# EAGLE design DummyLoad (EAGLE 5.10)

## Sheet 1 of 4
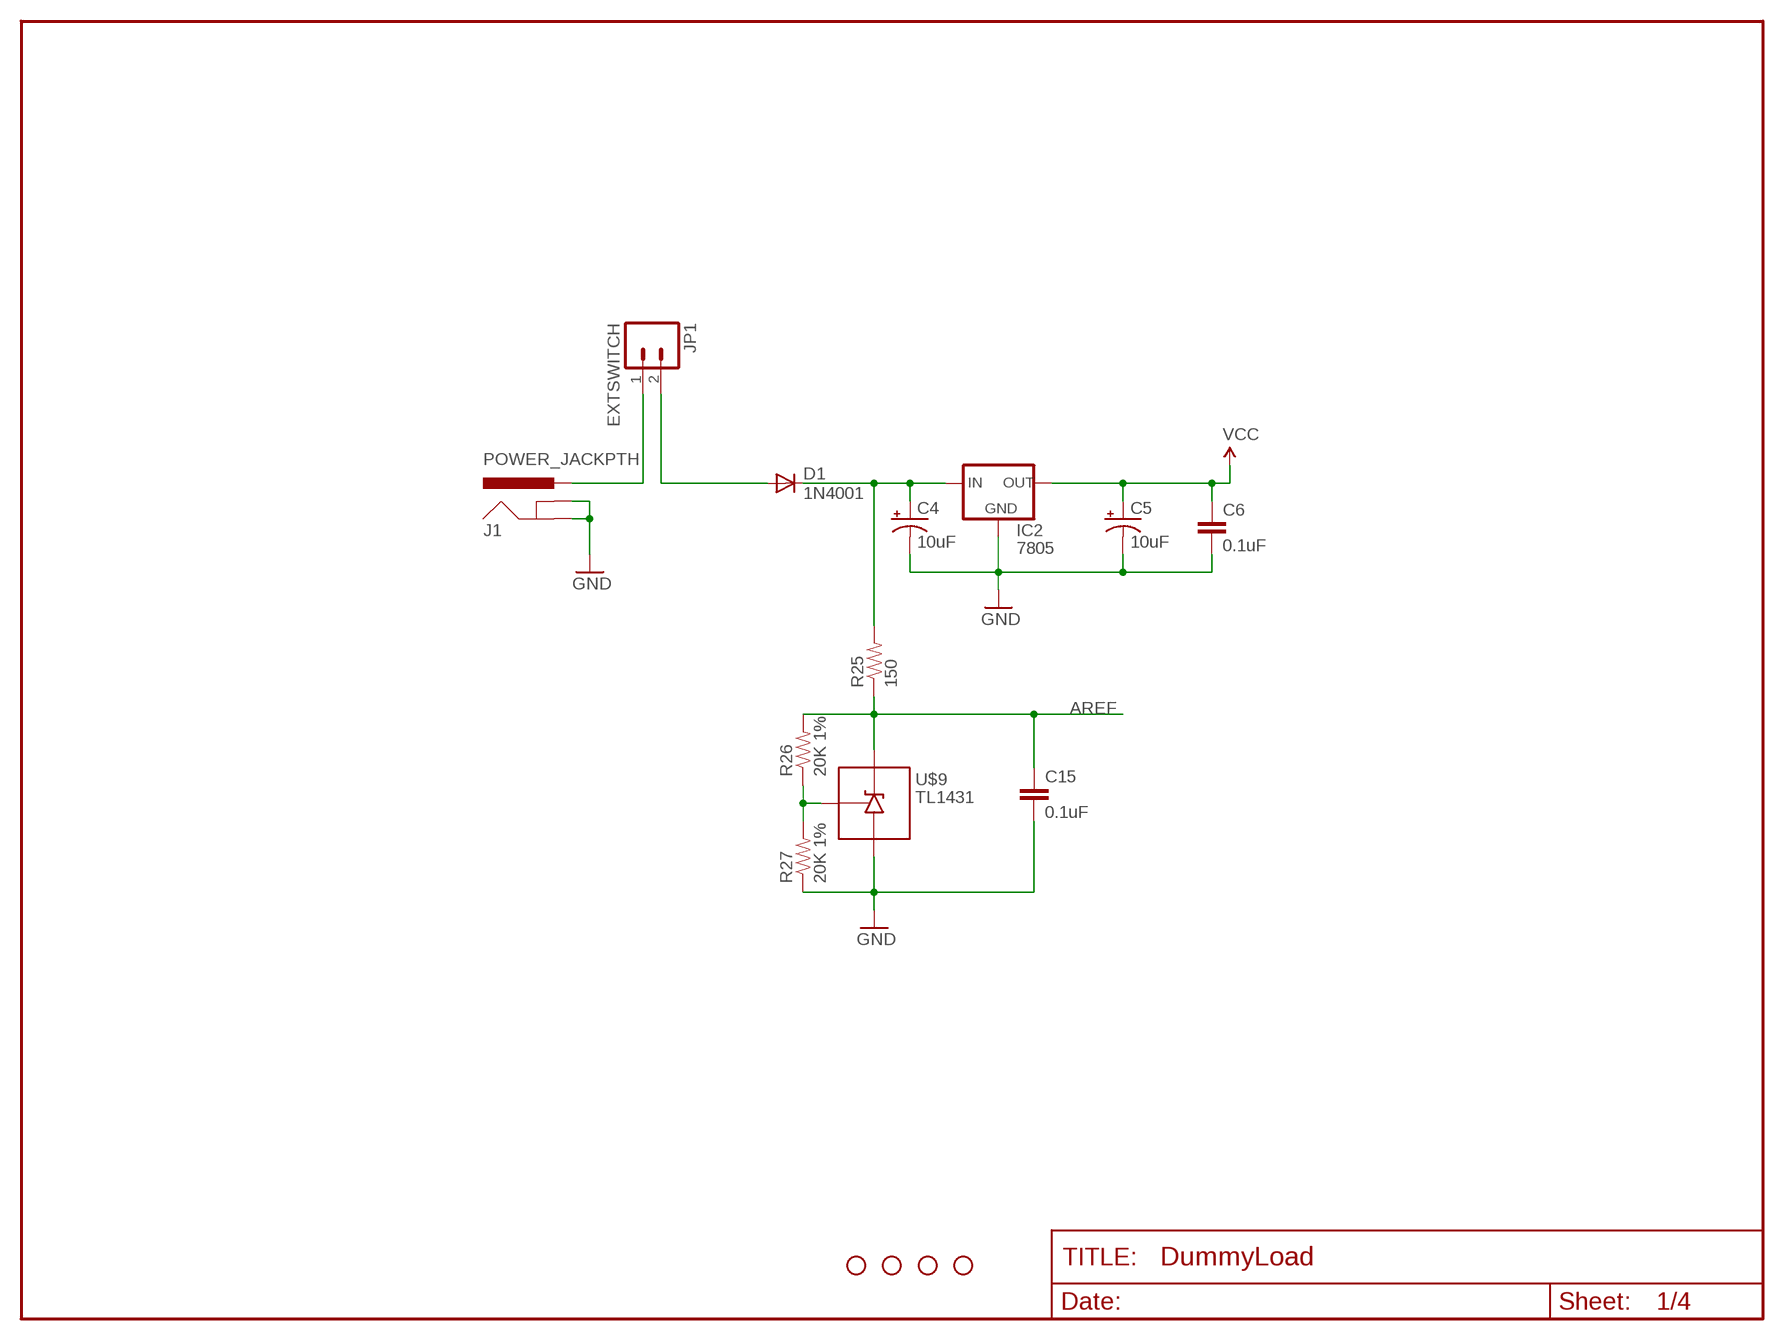
[diagram p0: schematic, sheet 1]

### Parts
C4  10uF  CAP_POLPTH2  [CPOL-RADIAL-10UF-25V]
C5  10uF  CAP_POLPTH2  [CPOL-RADIAL-10UF-25V]
C6  0.1uF  CAP1206  [1206]
C15  0.1uF  CAP1206  [1206]
D1  1N4001  DIODEPTH  [DIODE-1N4001]
IC2  7805  V_REG_78XXSINK  [TO220-IGO]
J1  POWER_JACKPTH  [POWER_JACK_PTH]
JP1  EXTSWITCH  M02PTH  [1X02]
R25  150  RESISTOR1206  [1206]
R26  20K 1%  RESISTOR1206  [1206]
R27  20K 1%  RESISTOR1206  [1206]
U$9  TL1431  [TO-92]
U$11  STANDOFF  [STANDOFF_0.14]
U$12  STANDOFF  [STANDOFF_0.14]
U$13  STANDOFF  [STANDOFF_0.14]
U$14  STANDOFF  [STANDOFF_0.14]

### Nets
AREF: C15.1 R25.1 R26.2 U$9.3(C) ; also sheet 2
GND: C4.2(-) C5.2(-) C6.2 C15.2 IC2.GND J1.GND J1.GNDBREAK R27.1 U$9.2(A) ; also sheet 2,3,4
N$1: J1.PWR JP1.1
N$2: C4.1(+) D1.C IC2.IN R25.2
N$21: D1.A JP1.2
VCC: C5.1(+) C6.1 IC2.OUT ; also sheet 2,3,4
VREF: R26.1 R27.2 U$9.1(REF)

## Sheet 2 of 4
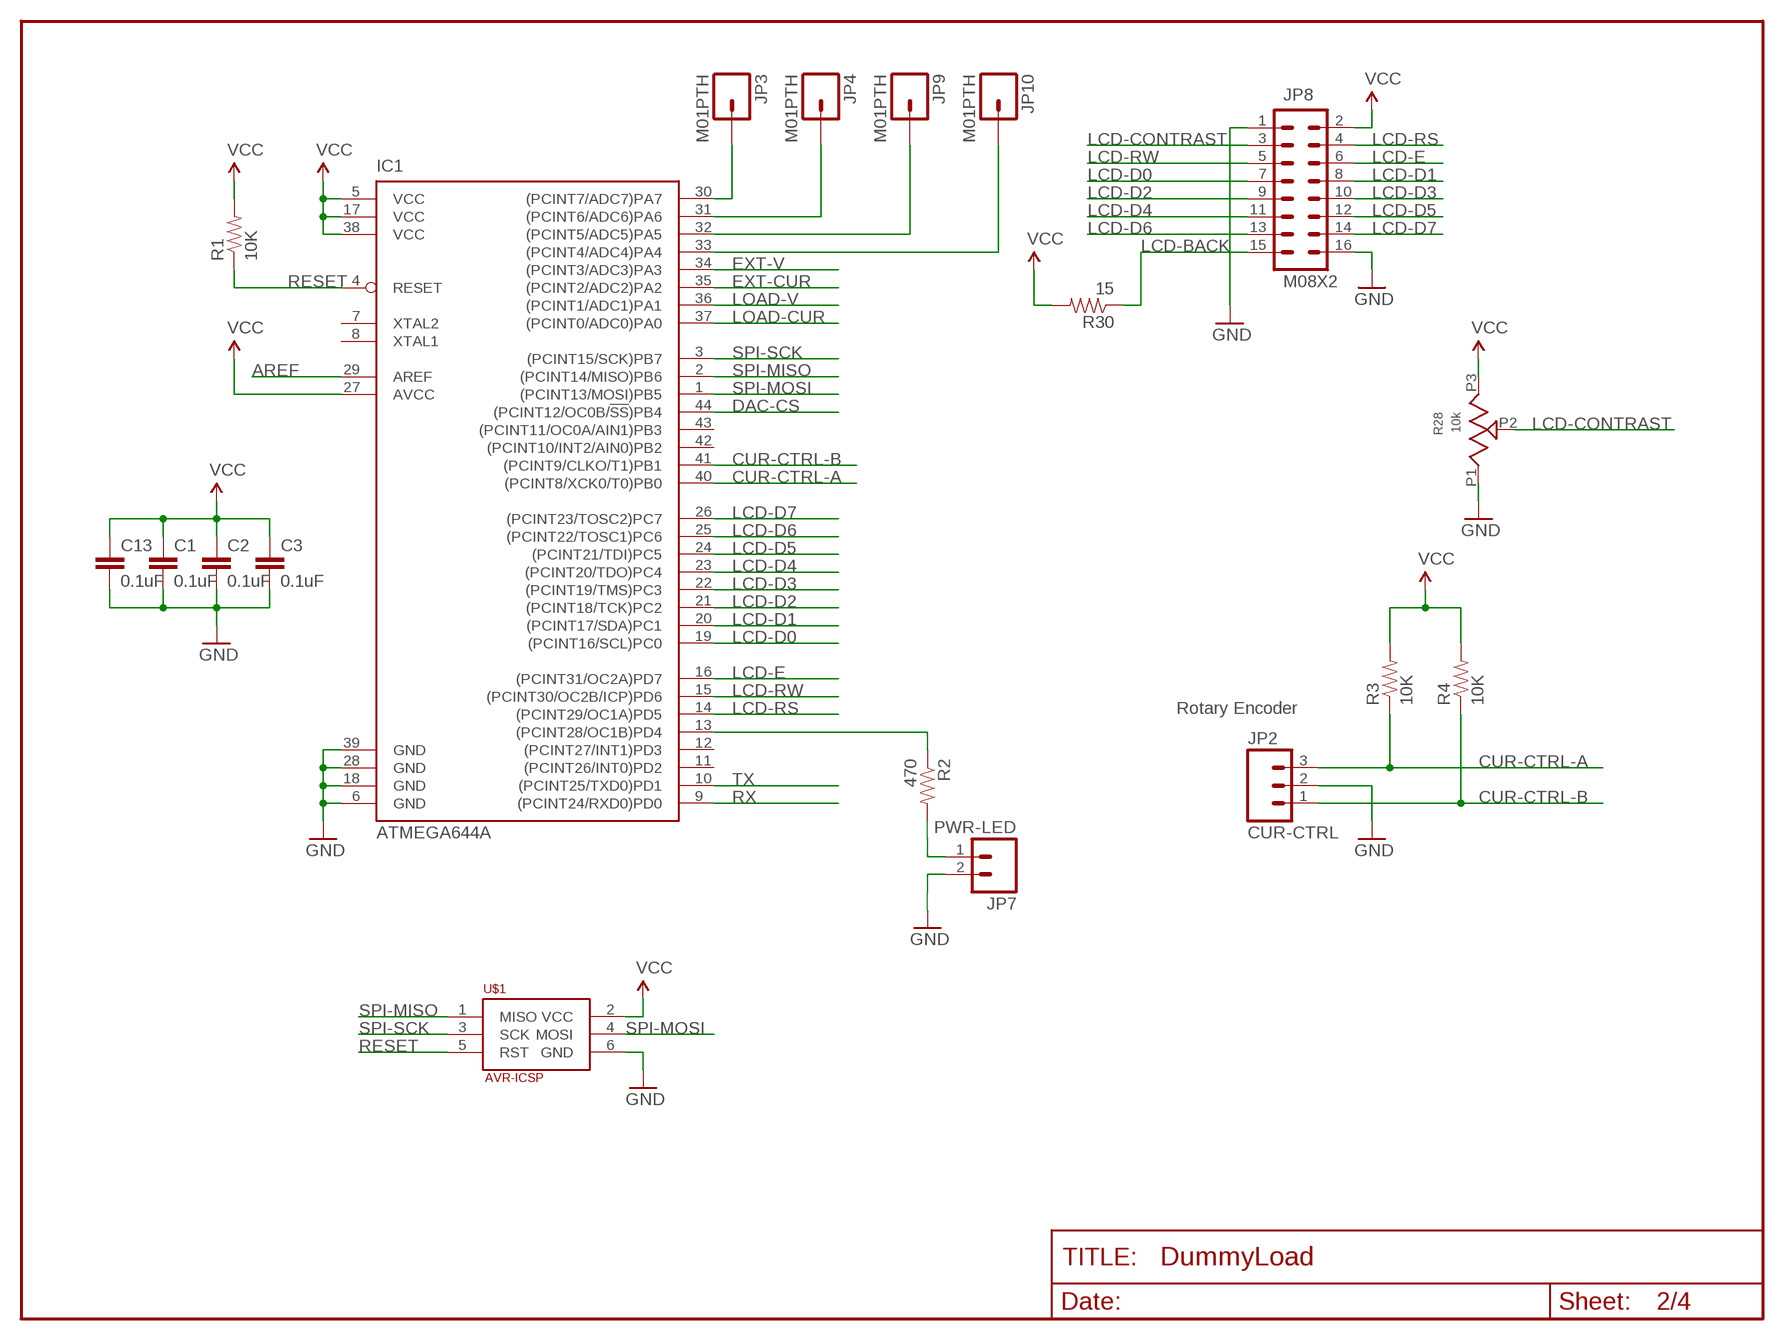
[diagram p1: schematic, sheet 2]

### Parts
C1  0.1uF  CAP1206  [1206]
C2  0.1uF  CAP1206  [1206]
C3  0.1uF  CAP1206  [1206]
C13  0.1uF  CAP1206  [1206]
IC1  ATMEGA644A  [TQFP44]
JP2  CUR-CTRL  M03PTH  [1X03]
JP3  M01PTH  [1X01]
JP4  M01PTH  [1X01]
JP7  PWR-LED  M02PTH  [1X02]
JP8  M08X2  [2X8]
JP9  M01PTH  [1X01]
JP10  M01PTH  [1X01]
R1  10K  RESISTOR1206  [1206]
R2  470  RESISTOR1206  [1206]
R3  10K  RESISTOR1206  [1206]
R4  10K  RESISTOR1206  [1206]
R28  10k  POT-3362H  [POT-3362H]
R30  15  RESISTOR1206  [1206]
U$1  AVR-ICSP  [AVR-ICSP]

### Nets
AREF: IC1.29(AREF) ; also sheet 1
CUR-CTRL-A: IC1.40((PCINT8/XCK0/T0)PB0) JP2.3 R3.1
CUR-CTRL-B: IC1.41((PCINT9/CLKO/T1)PB1) JP2.1 R4.1
DAC-CS: IC1.44((PCINT12/OC0B/!SS!)PB4) ; also sheet 3
EXT-CUR: IC1.35((PCINT2/ADC2)PA2) ; also sheet 3
EXT-V: IC1.34((PCINT3/ADC3)PA3) ; also sheet 3
GND: C1.2 C2.2 C3.2 C13.2 IC1.6(GND) IC1.18(GND) IC1.28(GND) IC1.39(GND) JP2.2 JP7.2 JP8.1 JP8.16 R28.P1(PA) U$1.6(GND) ; also sheet 1,3,4
LCD-BACK: JP8.15 R30.1
LCD-CONTRAST: JP8.3 R28.P2(PWIPER)
LCD-D0: IC1.19((PCINT16/SCL)PC0) JP8.7
LCD-D1: IC1.20((PCINT17/SDA)PC1) JP8.8
LCD-D2: IC1.21((PCINT18/TCK)PC2) JP8.9
LCD-D3: IC1.22((PCINT19/TMS)PC3) JP8.10
LCD-D4: IC1.23((PCINT20/TDO)PC4) JP8.11
LCD-D5: IC1.24((PCINT21/TDI)PC5) JP8.12
LCD-D6: IC1.25((PCINT22/TOSC1)PC6) JP8.13
LCD-D7: IC1.26((PCINT23/TOSC2)PC7) JP8.14
LCD-E: IC1.16((PCINT31/OC2A)PD7) JP8.6
LCD-RS: IC1.14((PCINT29/OC1A)PD5) JP8.4
LCD-RW: IC1.15((PCINT30/OC2B/ICP)PD6) JP8.5
LOAD-CUR: IC1.37((PCINT0/ADC0)PA0) ; also sheet 3
LOAD-V: IC1.36((PCINT1/ADC1)PA1) ; also sheet 3
N$3: IC1.13((PCINT28/OC1B)PD4) R2.1
N$4: JP7.1 R2.2
N$22: IC1.30((PCINT7/ADC7)PA7) JP3.1
N$23: IC1.31((PCINT6/ADC6)PA6) JP4.1
N$24: IC1.32((PCINT5/ADC5)PA5) JP9.1
N$25: IC1.33((PCINT4/ADC4)PA4) JP10.1
RESET: IC1.4(RESET) R1.1 U$1.5(RST)
RX: IC1.9((PCINT24/RXD0)PD0) ; also sheet 4
SPI-MISO: IC1.2((PCINT14/MISO)PB6) U$1.1(MISO)
SPI-MOSI: IC1.1((PCINT13/MOSI)PB5) U$1.4(MOSI) ; also sheet 3
SPI-SCK: IC1.3((PCINT15/SCK)PB7) U$1.3(SCK) ; also sheet 3
TX: IC1.10((PCINT25/TXD0)PD1) ; also sheet 4
VCC: C1.1 C2.1 C3.1 C13.1 IC1.5(VCC) IC1.17(VCC) IC1.27(AVCC) IC1.38(VCC) JP8.2 R1.2 R3.2 R4.2 R28.P3(PB) R30.2 U$1.2(VCC) ; also sheet 1,3,4
Unconnected: IC1.7(XTAL2) IC1.8(XTAL1) IC1.11((PCINT26/INT0)PD2) IC1.12((PCINT27/INT1)PD3) IC1.42((PCINT10/INT2/AIN0)PB2) IC1.43((PCINT11/OC0A/AIN1)PB3)

### Notes on the sheet
- Rotary Encoder

## Sheet 3 of 4
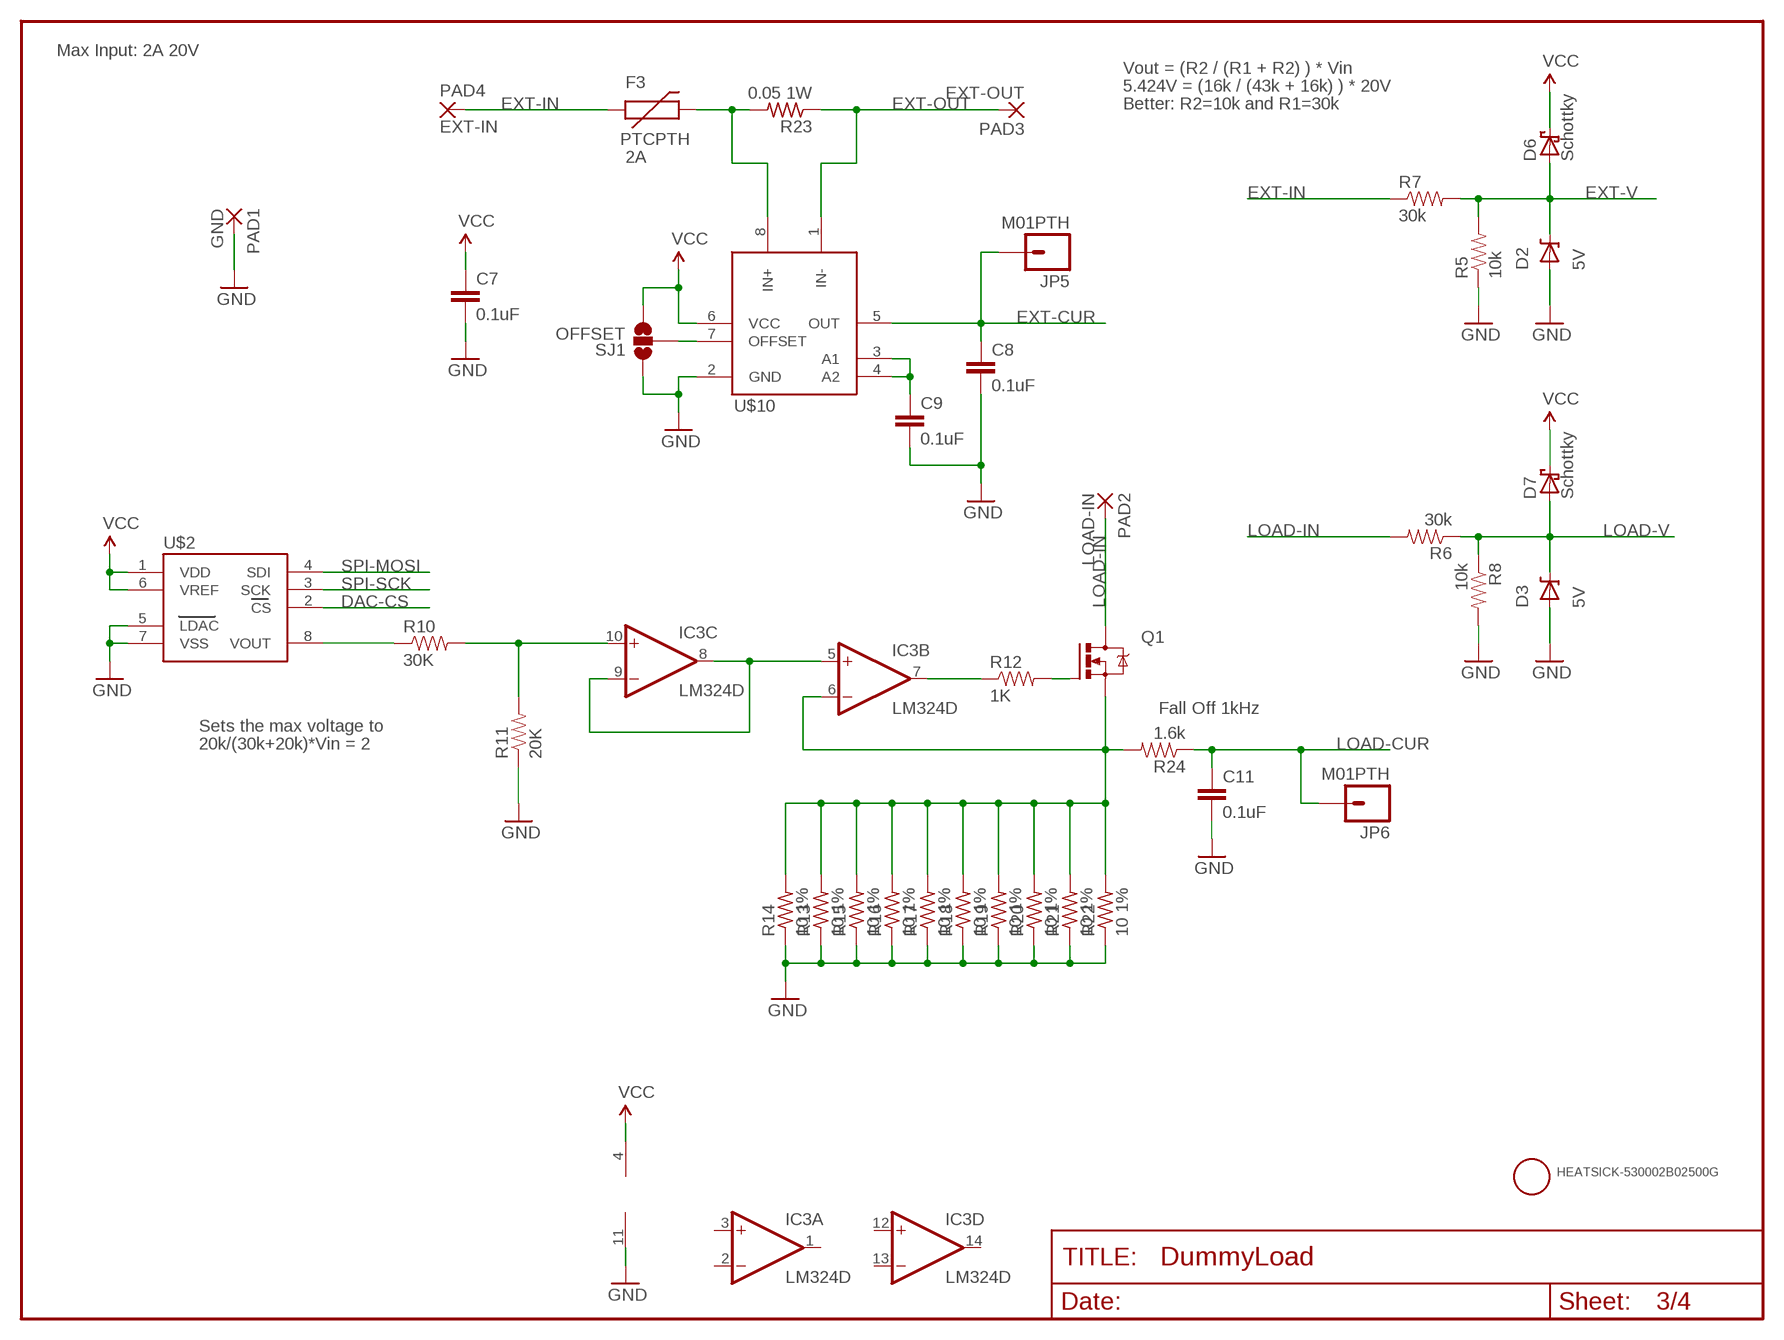
[diagram p2: schematic, sheet 3]

### Parts
C7  0.1uF  CAP1206  [1206]
C8  0.1uF  CAP1206  [1206]
C9  0.1uF  CAP1206  [1206]
C11  0.1uF  CAP1206  [1206]
D2  DIODE-ZENERPTH  [DIODE-ZENER]
D3  DIODE-ZENERPTH  [DIODE-ZENER]
D6  Schottky  DIODE-SCHOTTKY  [DIODE]
D7  Schottky  DIODE-SCHOTTKY  [DIODE]
F3  PTCPTH  [PTC]
IC3  LM324D  [SO14]
JP5  M01PTH  [1X01]
JP6  M01PTH  [1X01]
PAD1  GND  3,17/1,3  [3,17/1,3]
PAD2  LOAD-IN  3,17/1,3  [3,17/1,3]
PAD3  EXT-OUT  3,17/1,3  [3,17/1,3]
PAD4  EXT-IN  3,17/1,3  [3,17/1,3]
Q1  IRF520  [TO220BV]
R5  10k  RESISTOR1206  [1206]
R6  30k  RESISTOR1206  [1206]
R7  30k  RESISTOR1206  [1206]
R8  10k  RESISTOR1206  [1206]
R10  30K  RESISTOR1206  [1206]
R11  20K  RESISTOR1206  [1206]
R12  1K  RESISTOR1206  [1206]
R13  10 1%  R-US_0411/15  [0411/15]
R14  10 1%  R-US_0411/15  [0411/15]
R15  10 1%  R-US_0411/15  [0411/15]
R16  10 1%  R-US_0411/15  [0411/15]
R17  10 1%  R-US_0411/15  [0411/15]
R18  10 1%  R-US_0411/15  [0411/15]
R19  10 1%  R-US_0411/15  [0411/15]
R20  10 1%  R-US_0411/15  [0411/15]
R21  10 1%  R-US_0411/15  [0411/15]
R22  10 1%  R-US_0411/15  [0411/15]
R23  0.05 1W  R-US_0617/17  [0617/17]
R24  1.6k  RESISTOR1206  [1206]
SJ1  OFFSET  SOLDERJUMPER_2WAYS  [SJ_3]
U$2  MCP49X1  [TSSOP8]
U$5  HEATSINK-530002B02500G  [HEATSINK-530002B02500G]
U$10  LMP8602  [SOIC-8]

### Nets
DAC-CS: U$2.2(CS) ; also sheet 2
EXT-CUR: C8.1 JP5.1 U$10.5(OUT) ; also sheet 2
EXT-IN: F3.P$1 PAD4.1(P) R7.1
EXT-OUT: PAD3.1(P) R23.1 U$10.1(IN-)
EXT-V: D2.P$1(C) D6.P$1(A) R5.2 R7.2 ; also sheet 2
GND: C7.2 C8.2 C9.2 C11.2 D2.P$2(A) D3.P$2(A) IC3.11(P:V-) PAD1.1(P) R5.1 R8.2 R11.1 R13.1 R14.1 R15.1 R16.1 R17.1 R18.1 R19.1 R20.1 R21.1 R22.1 SJ1.1 U$2.5(LDAC) U$2.7(VSS) U$10.2(GND) ; also sheet 1,2,4
LOAD-CUR: C11.1 JP6.1 R24.1 ; also sheet 2
LOAD-IN: PAD2.1(P) Q1.D R6.2
LOAD-V: D3.P$1(C) D7.P$1(A) R6.1 R8.1 ; also sheet 2
LOADOUT: IC3.6(B:-IN) Q1.S R13.2 R14.2 R15.2 R16.2 R17.2 R18.2 R19.2 R20.2 R21.2 R22.2 R24.2
N$5: F3.P$2 R23.2 U$10.8(IN+)
N$6: R10.1 U$2.8(VOUT)
N$7: IC3.10(C:+IN) R10.2 R11.2
N$9: IC3.7(B:OUT) R12.1
N$10: IC3.5(B:+IN) IC3.8(C:OUT) IC3.9(C:-IN)
N$11: Q1.G R12.2
N$12: C9.1 U$10.3(A1) U$10.4(A2)
N$26: SJ1.2 U$10.7(OFFSET)
SPI-MOSI: U$2.4(SDI) ; also sheet 2
SPI-SCK: U$2.3(SCK) ; also sheet 2
VCC: C7.1 D6.P$2(C) D7.P$2(C) IC3.4(P:V+) SJ1.3 U$2.1(VDD) U$2.6(VREF) U$10.6(VCC) ; also sheet 1,2,4
Unconnected: IC3.1(A:OUT) IC3.2(A:-IN) IC3.3(A:+IN) IC3.12(D:+IN) IC3.13(D:-IN) IC3.14(D:OUT)

### Notes on the sheet
- Max Input: 2A 20V
- Vout = (R2 / (R1 + R2) ) * Vin
- 5.424V = (16k / (43k + 16k) ) * 20V
- Better: R2=10k and R1=30k
- 2A
- 5V
- 5V
- Fall Off 1kHz
- Sets the max voltage to
- 20k/(30k+20k)*Vin = 2

## Sheet 4 of 4
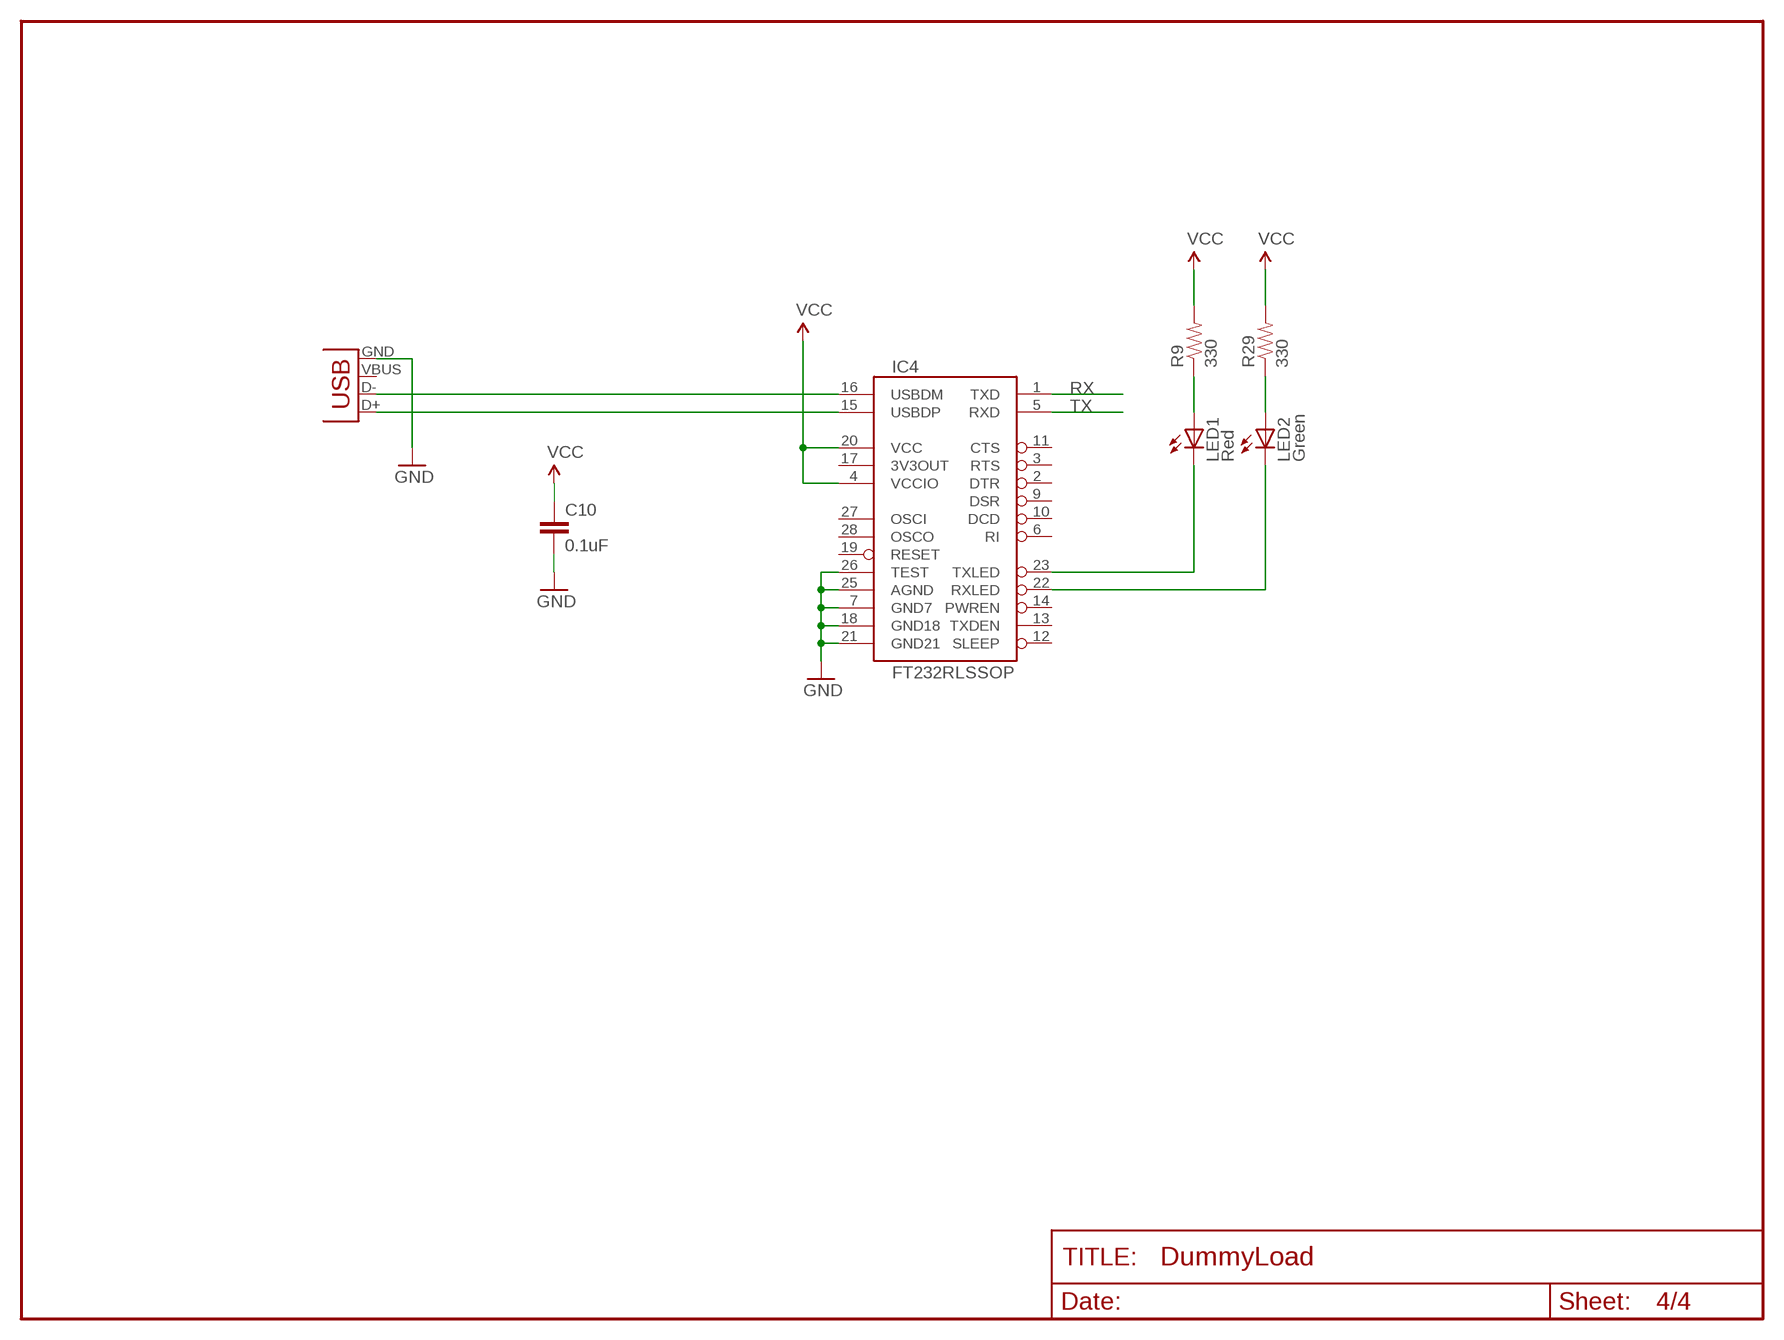
[diagram p3: schematic, sheet 4]

### Parts
C10  0.1uF  CAP1206  [1206]
IC4  FT232RLSSOP  [SSOP28DB]
LED1  Red  LED1206  [LED-1206]
LED2  Green  LED1206  [LED-1206]
R9  330  RESISTOR1206  [1206]
R29  330  RESISTOR1206  [1206]
X2  USBPTH  [USB-B-PTH]

### Nets
GND: C10.2 IC4.7(GND7) IC4.18(GND18) IC4.21(GND21) IC4.25(AGND) IC4.26(TEST) X2.GND ; also sheet 1,2,3
N$14: IC4.16(USBDM) X2.D-
N$15: IC4.15(USBDP) X2.D+
N$17: IC4.23(TXLED) LED1.C
N$18: LED1.A R9.1
N$19: IC4.22(RXLED) LED2.C
N$20: LED2.A R29.1
RX: IC4.1(TXD) ; also sheet 2
TX: IC4.5(RXD) ; also sheet 2
VCC: C10.1 IC4.4(VCCIO) IC4.20(VCC) R9.2 R29.2 ; also sheet 1,2,3
Unconnected: IC4.2(DTR) IC4.3(RTS) IC4.6(RI) IC4.9(DSR) IC4.10(DCD) IC4.11(CTS) IC4.12(SLEEP) IC4.13(TXDEN) IC4.14(PWREN) IC4.17(3V3OUT) IC4.19(RESET) IC4.27(OSCI) IC4.28(OSCO) X2.VBUS

## Library data of the parts
C1-C3 C6-C11 C13 C15 = SparkFun:CAP: Capacitor Standard 0603 ceramic capacitor, and 0.1" leaded capacitor.
C4 C5 = SparkFun:CAP_POL: Capacitor Polarized These are standard SMD and PTH capacitors. Normally 10uF, 47uF, and 100uF in electrolytic and tantalum varieties. Always verify the external diameter of the through hole cap, it varies with capacity, voltage, and manufacturer. The EIA devices should be standard.
D1 = SparkFun:DIODE: Diode These are standard reverse protection diodes and small signal diodes. SMA package can handle up to about 1A. SOD-323 can handle about 200mA. What the SOD-323 package when ordering, there are some mfgs out there that are 5-pin packages.
D2 D3 = SparkFun:DIODE-ZENER: Zener Diode Production Part - 8199 3.4V Zener Voltage
D6 D7 = FiveVolt:DIODE-SCHOTTKY
F3 = SparkFun:PTC: Resettable Fuse PTC Resettable Fuse. Spark Fun Electronics SKU : COM-08357
IC1 = atmel:ATMEGA644: 8-bit Microcontroller with 64K Bytes In-System Programmable Flash Source: http://www.atmel.com/dyn/resources/prod_documents/doc2593.pdf
IC2 = SparkFun:V_REG_78XX: Voltage Regulator Standard 7805 5V regulator. IGO (Input Ground Output). Spark Fun Electronics SKU : COM-00107
IC3 = linear:LM324: OP AMP
IC4 = SparkFun:FT232RL: USB UART FT232RL 4th Generation USB UART (USB <-> Serial) Controller. Spark Fun Electronics SKU : COM-00650
J1 = SparkFun:POWER_JACK: Power Jack This is the standard 5.5mm barrel jack for power. The PTH is the most common, proven, reliable, footprint. All others are experimental. The Slot footprint only works if the mill layer is transmitted to the PCB fab house so be warned. Spark Fun Electronics SKU : PRT-00119. Mating wall wart : TOL-00298 (and others)
JP1 JP7 = SparkFun:M02: Header 2 Standard 2-pin 0.1" header. Use with straight break away headers (SKU : PRT-00116), right angle break away headers (PRT-00553), swiss pins (PRT-00743), machine pins (PRT-00117), and female headers (PRT-00115). Molex polarized connector foot print use with SKU : PRT-08233 with associated crimp pins and housings.
JP2 = SparkFun:M03: Header 3 Standard 3-pin 0.1" header. Use with straight break away headers (SKU : PRT-00116), right angle break away headers (PRT-00553), swiss pins (PRT-00743), machine pins (PRT-00117), and female headers (PRT-00115). Molex polarized connector foot print use with SKU : PRT-08232 with associated crimp pins and housings.
JP3-JP6 JP9 JP10 = SparkFun:M01: Header 1 Standard 1-pin 0.1" header. Use with straight break away headers (SKU : PRT-00116), right angle break away headers (PRT-00553), swiss pins (PRT-00743), machine pins (PRT-00117), and female headers (PRT-00115).
JP8 = SparkFun:M08X2
LED1 LED2 = SparkFun:LED: LEDs Standard schematic elements and footprints for 5mm, 3mm, 1206, and 0603 sized LEDs. 5mm - Spark Fun Electronics SKU : COM-00529 (and others)
PAD1-PAD4 = wirepad:3,17/1,3: THROUGH-HOLE PAD
Q1 = transistor-power:IRF520: HEXFET Power MOSFET
R1-R12 R24-R27 R29 R30 = SparkFun:RESISTOR: Resistor Basic schematic elements and footprints for 0603, 1206, and PTH 1/10th watt (small) resistors.
R13-R23 = resistor:R-US_: RESISTOR, American symbol
R28 = FiveVolt:POT-3362H
SJ1 = SparkFun:SOLDERJUMPER_2WAY: Solder Jumper 2 way solder jumper
U$1 = FiveVolt:AVR-ICSP
U$2 = FiveVolt:MCP49X1: 8/10/12-Bit Voltage Output Digital-to-Analog Converter with SPI Interface
U$5 = FiveVolt:HEATSINK-530002B02500G
U$9 = FiveVolt:TL1431: Adjustable Voltage Reference
U$10 = FiveVolt:LMP8602
U$11-U$14 = FiveVolt:STANDOFF
X2 = SparkFun:USB: USB Connectors USB-B-PTH is fully proven SKU : PRT-00139 USB-miniB is fully proven SKU : PRT-00587 USB-A-PCB is untested. USB-A-H is throughly reviewed, but untested. Spark Fun Electronics SKU : PRT-00437 USB-B-SMT is throughly reviewed, but untested. Needs silkscreen touching up. USB-A-S has not been used/tested USB-MB-H has not been used/tested

## Board
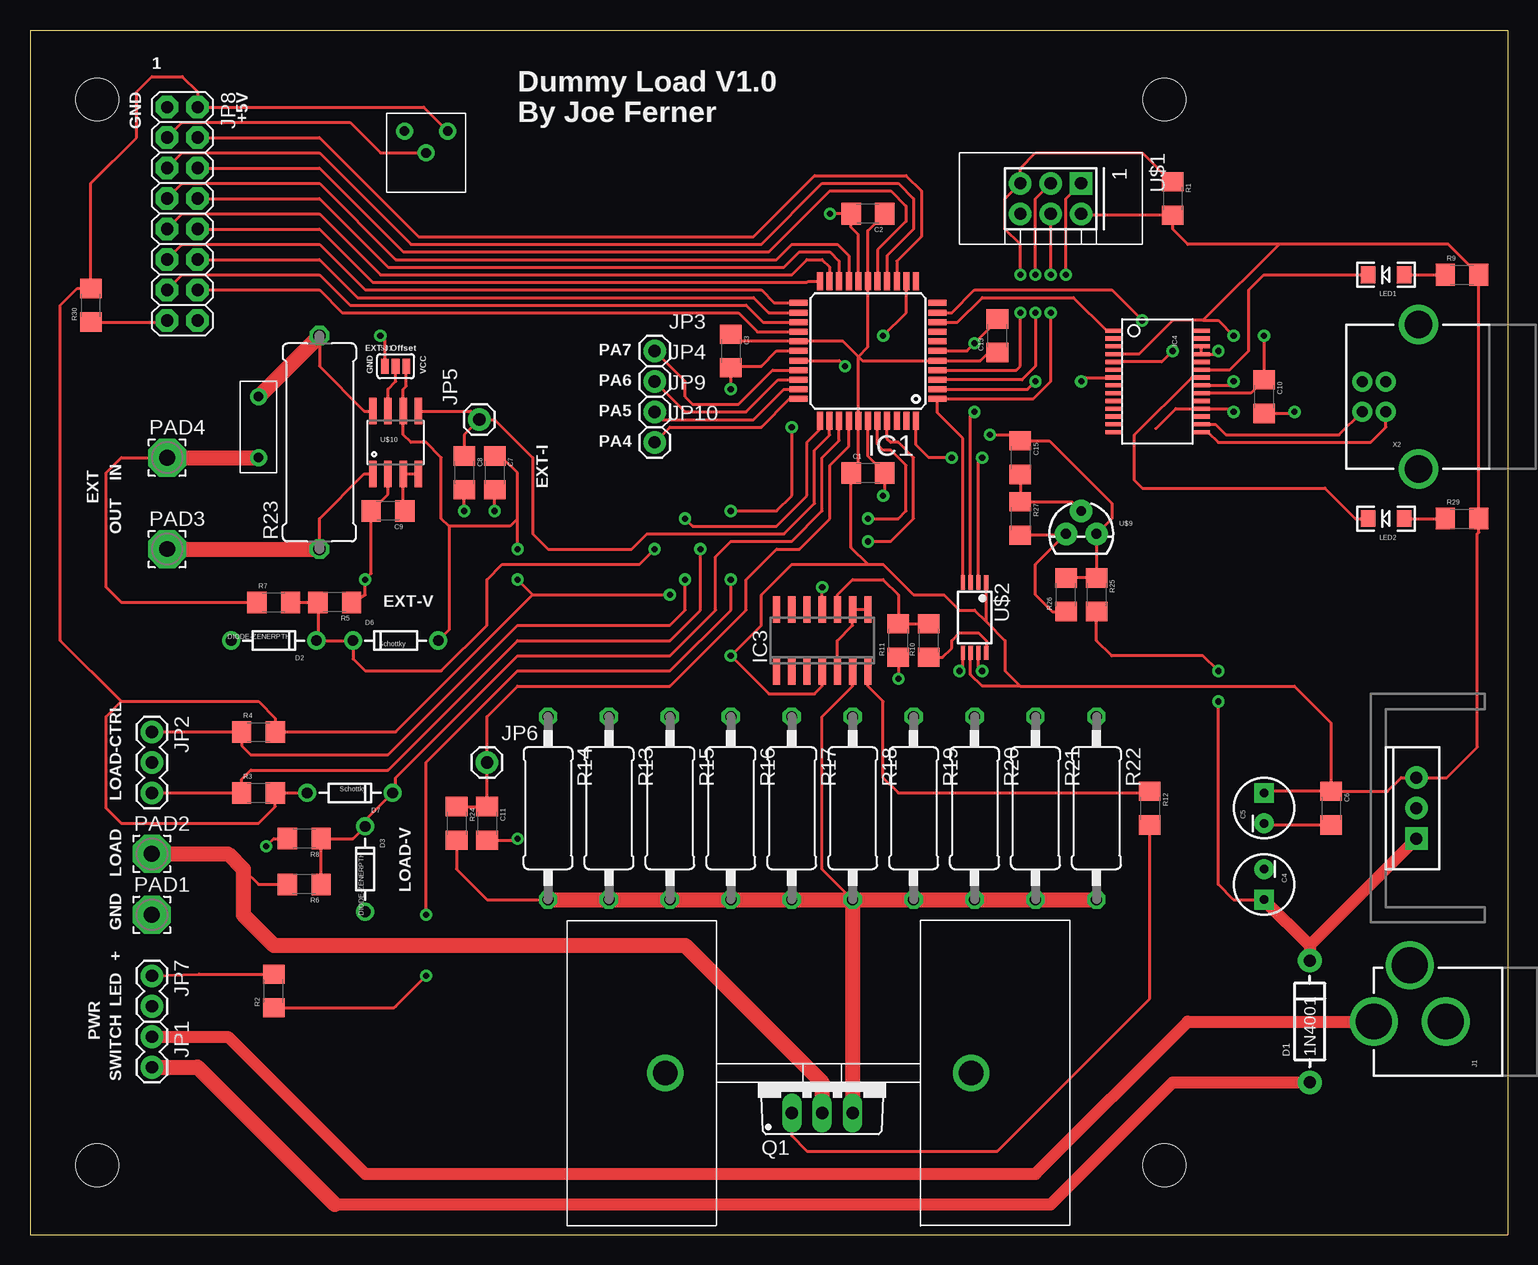
[diagram p4: board, top side]
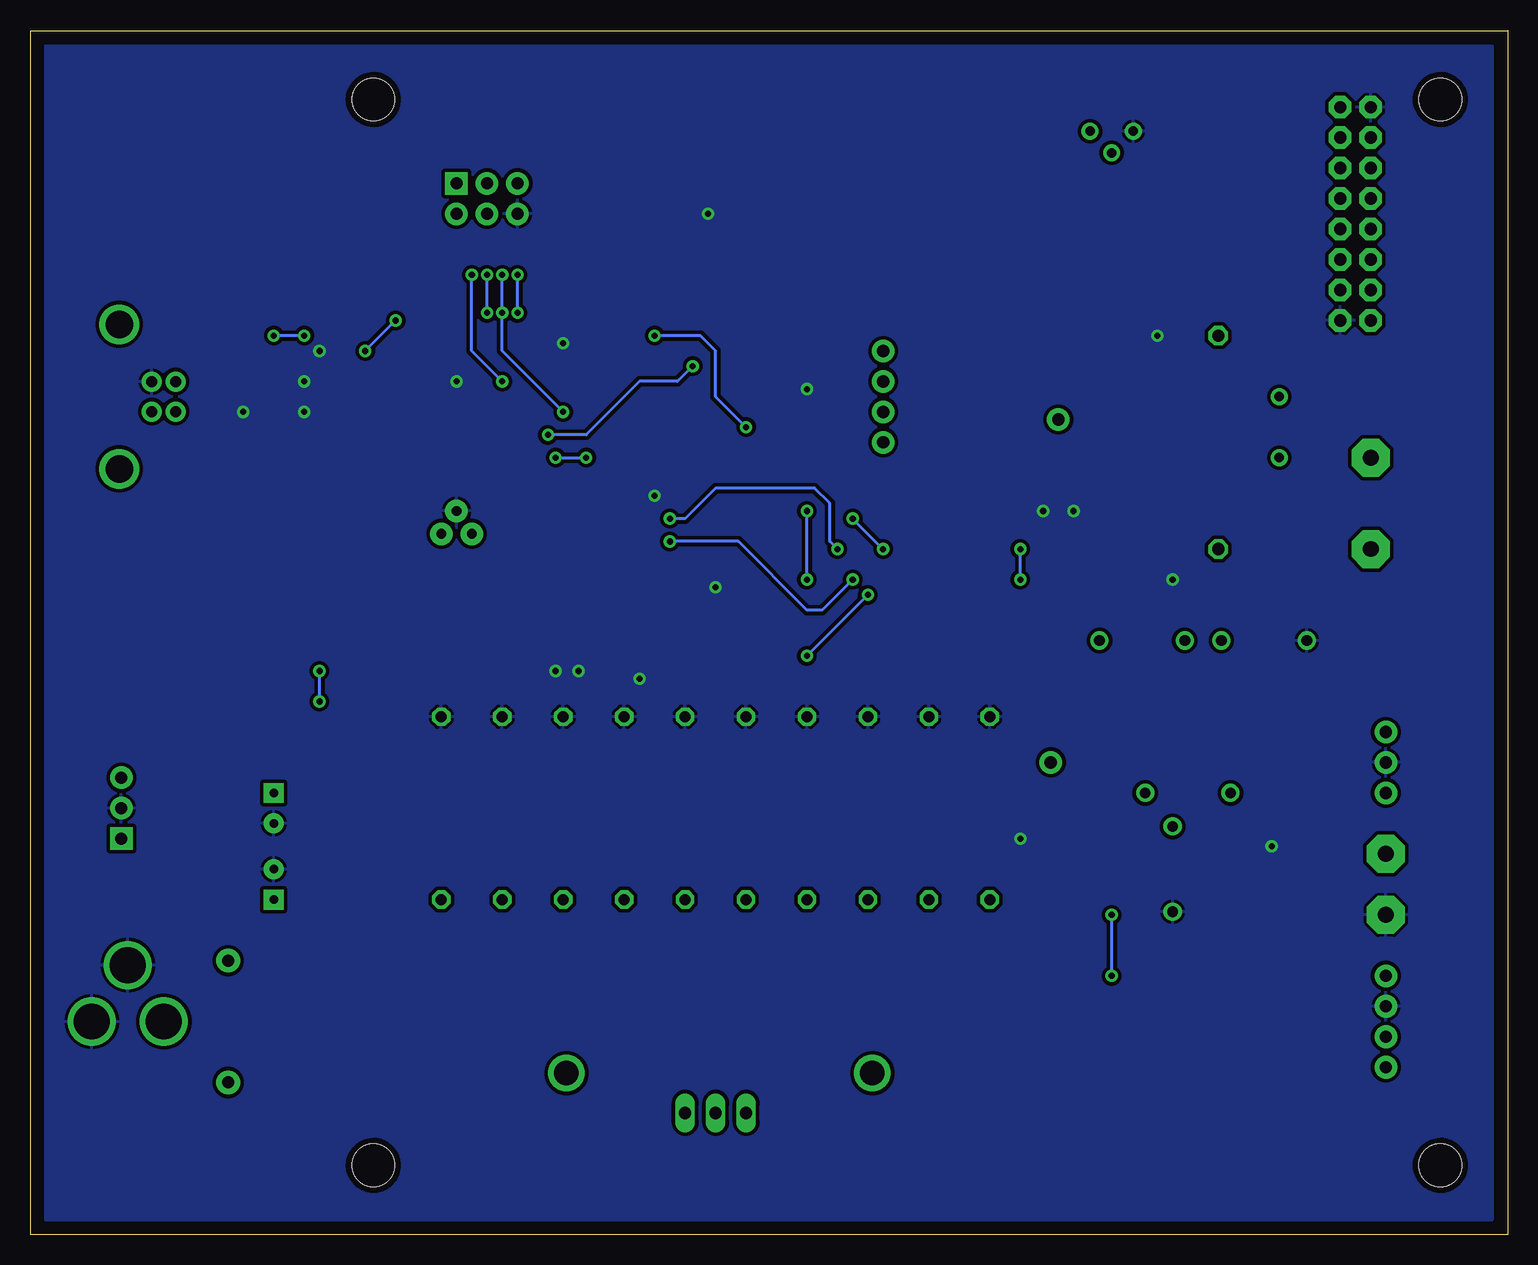
[diagram p5: board, bottom side, seen from below]

Size 123.19 x 100.41 mm. Coordinates in mm from the lower left corner, seen from the top.
Outline: 0,100.41 0,100.33
Outline: 0,100.33 0,0 123.19,0 123.19,100.33 0,100.33
Copper layers (1*16): Top 0.035mm / dielectric 1.5mm / Bottom 0.035mm
Design rules "SparkFun": minimum track width 8mil, minimum drill 20mil, track to track 8mil, track to pad 8mil, pad to pad 8mil, via to via 8mil, smd to smd 8mil, copper to edge 10mil, drill to drill 8mil, minimum pad ring 12mil, minimum via ring 10mil, stop-mask expansion 4mil, vias tented up to drill 25mil, thermal gap 10mil

### Footprints (pad centres in the part's own frame; a part is rotated, then mirrored left to right if it is on the bottom)
1206 = smd 1.6 x 1.8: 1 -1.4,0; 2 1.4,0
CPOL-RADIAL-10UF-25V = drill 0.7 pad 1.651 square: 1 1.27,0 | drill 0.7 pad 1.651 round: 2 -1.27,0
DIODE-1N4001 = drill 1 pad 1.981 round: A -5.08,0; C 5.08,0
DIODE-ZENER = drill 0.9 round: P$1 -3.556,0; P$2 3.556,0
DIODE = drill 0.9 round: P$1 -3.556,0; P$2 3.556,0
PTC = drill 0.8 round: P$1 -2.54,0; P$2 2.54,0
TQFP44 = smd 1.5 x 0.5: 1 -5.8,4; 2 -5.8,3.2; 3 -5.8,2.4; 4 -5.8,1.6; 5 -5.8,0.8; 6 -5.8,0; 7 -5.8,-0.8; 8 -5.8,-1.6; 9 -5.8,-2.4; 10 -5.8,-3.2; 11 -5.8,-4; 23 5.8,-4; 24 5.8,-3.2; 25 5.8,-2.4; 26 5.8,-1.6; 27 5.8,-0.8; 28 5.8,0; 29 5.8,0.8; 30 5.8,1.6; 31 5.8,2.4; 32 5.8,3.2; 33 5.8,4 | smd 0.5 x 1.5: 12 -4,-5.8; 13 -3.2,-5.8; 14 -2.4,-5.8; 15 -1.6,-5.8; 16 -0.8,-5.8; 17 0,-5.8; 18 0.8,-5.8; 19 1.6,-5.8; 20 2.4,-5.8; 21 3.2,-5.8; 22 4,-5.8; 34 4,5.8; 35 3.2,5.8; 36 2.4,5.8; 37 1.6,5.8; 38 0.8,5.8; 39 0,5.8; 40 -0.8,5.8; 41 -1.6,5.8; 42 -2.4,5.8; 43 -3.2,5.8; 44 -4,5.8
TO220-IGO = drill 1 pad 1.88 round: GND 0,0; OUT 2.54,0 | drill 1 pad 1.88 square: IN -2.54,0
SO14 = smd 0.6 x 2.2: 1 -3.81,-2.6; 2 -2.54,-2.6; 3 -1.27,-2.6; 4 0,-2.6; 5 1.27,-2.6; 6 2.54,-2.6; 7 3.81,-2.6; 8 3.81,2.6; 9 2.54,2.6; 10 1.27,2.6; 11 0,2.6; 12 -1.27,2.6; 13 -2.54,2.6; 14 -3.81,2.6
SSOP28DB = smd 0.348 x 1.397: 1 -4.225,-3.656; 2 -3.575,-3.656; 3 -2.925,-3.656; 4 -2.275,-3.656; 5 -1.625,-3.656; 6 -0.975,-3.656; 7 -0.325,-3.656; 8 0.325,-3.656; 9 0.975,-3.656; 10 1.625,-3.656; 11 2.275,-3.656; 12 2.925,-3.656; 13 3.575,-3.656; 14 4.225,-3.656; 15 4.225,3.656; 16 3.575,3.656; 17 2.925,3.656; 18 2.275,3.656; 19 1.625,3.656; 20 0.975,3.656; 21 0.325,3.656; 22 -0.325,3.656; 23 -0.975,3.656; 24 -1.625,3.656; 25 -2.275,3.656; 26 -2.925,3.656; 27 -3.575,3.656; 28 -4.225,3.656
POWER_JACK_PTH = drill 2.997 round: GND 0,7.7; GNDBREAK 4.7,10.7; PWR 0,13.7
1X02 = drill 1.016 pad 1.88 round: 1 0,0; 2 2.54,0
1X03 = drill 1.016 pad 1.88 round: 1 0,0; 2 2.54,0; 3 5.08,0
1X01 = drill 1.016 pad 1.88 round: 1 0,0
2X8 = drill 1.016 pad 1.88 octagon: 1 0,0; 2 0,2.54; 3 2.54,0; 4 2.54,2.54; 5 5.08,0; 6 5.08,2.54; 7 7.62,0; 8 7.62,2.54; 9 10.16,0; 10 10.16,2.54; 11 12.7,0; 12 12.7,2.54; 13 15.24,0; 14 15.24,2.54; 15 17.78,0; 16 17.78,2.54
LED-1206 = smd 1.2 x 1.4: A -1.5,0; C 1.5,0
3,17/1,3 = drill 1.321 pad 3.175 octagon: 1 0,0
TO220BV = drill 1.016 long: D 0,-2.54; G -2.54,-2.54; S 2.54,-2.54
0411/15 = drill 0.914 octagon: 1 -7.62,0; 2 7.62,0
0617/17 = drill 1.016 octagon: 1 -8.89,0; 2 8.89,0
POT-3362H = drill 0.8 round: P1 -1.803,1.803; P2 0,0; P3 1.803,1.803
SJ_3 = smd 0.635 x 1.27: 1 -0.889,0; 2 0,0; 3 0.889,0
AVR-ICSP = drill 1.016 pad 1.88 square: 1 -1.27,2.54 | drill 1.016 pad 1.88 round: 2 1.27,2.54; 3 -1.27,0; 4 1.27,0; 5 -1.27,-2.54; 6 1.27,-2.54
TSSOP8 = smd 1.2 x 0.35: 1 -2.925,0.975; 2 -2.925,0.325; 3 -2.925,-0.325; 4 -2.925,-0.975; 5 2.925,-0.975; 6 2.925,-0.325; 7 2.925,0.325; 8 2.925,0.975
HEATSINK-530002B02500G = drill 2.032 round: P$1 -13.068,0.785; P$2 12.432,0.785
TO-92 = drill 0.813 pad 1.88 round: 1 -1.27,0; 2 0,1.905; 3 1.27,0
SOIC-8 = smd 0.61 x 2.21: 1 -1.905,-2.616; 2 -0.635,-2.616; 3 0.635,-2.616; 4 1.905,-2.616; 5 1.905,2.616; 6 0.635,2.616; 7 -0.635,2.616; 8 -1.905,2.616
STANDOFF_0.14 = hole 3.556: 0,0
USB-B-PTH = drill 0.914 pad 1.676 round: D+ 0,1.25; D- 1.981,1.25; GND 0,-1.25; VBUS 1.981,-1.25 | drill 2.286 round: P$1 -2.718,-6.02; P$2 -2.718,6.02

### Placement (x,y rotation side)
C1  69.85,63.5 0 top
C2  69.85,85.09 180 top
C3  58.42,73.66 270 top
C4  102.87,29.21 270 top
C5  102.87,35.56 90 top
C6  108.46,35.56 270 top
C7  38.73,63.5 270 top
C8  36.2,63.5 270 top
C9  29.84,60.33 180 top
C10  102.87,69.85 270 top
C11  38.1,34.29 270 top
C13  80.64,74.93 90 top
C15  82.55,64.77 270 top
D1  106.68,17.78 90 top
D2  20.32,49.53 180 top
D3  27.94,30.48 270 top
D6  30.48,49.53 0 top
D7  26.67,36.83 180 top
F3  19.05,67.31 90 top
IC1  69.85,73.66 180 top
IC2  115.57,35.56 90 top
IC3  66.04,49.53 0 top
IC4  93.98,71.12 270 top
J1  125.73,17.78 90 top
JP1  10.16,16.51 270 top
JP2  10.16,41.91 270 top
JP3  52.07,73.66 0 top
JP4  52.07,71.12 0 top
JP5  37.47,67.94 90 top
JP6  38.1,39.37 0 top
JP7  10.16,21.59 270 top
JP8  11.43,93.98 270 top
JP9  52.07,68.58 0 top
JP10  52.07,66.04 0 top
LED1  113.03,80.01 180 top
LED2  113.03,59.69 180 top
PAD1  10.16,26.67 0 top
PAD2  10.16,31.75 0 top
PAD3  11.43,57.15 0 top
PAD4  11.43,64.77 0 top
Q1  66.04,12.7 0 top
R1  95.25,86.36 270 top
R2  20.32,20.32 90 top
R3  19.05,36.83 0 top
R4  19.05,41.91 0 top
R5  25.4,52.7 180 top
R6  22.86,29.21 180 top
R7  20.32,52.7 0 top
R8  22.86,33.02 180 top
R9  119.38,80.01 0 top
R10  74.93,49.53 90 top
R11  72.39,49.53 90 top
R12  93.34,35.56 270 top
R13  48.26,35.56 270 top
R14  43.18,35.56 270 top
R15  53.34,35.56 270 top
R16  58.42,35.56 270 top
R17  63.5,35.56 270 top
R18  68.58,35.56 270 top
R19  73.66,35.56 270 top
R20  78.74,35.56 270 top
R21  83.82,35.56 270 top
R22  88.9,35.56 270 top
R23  24.13,66.04 90 top
R24  35.56,34.29 270 top
R25  88.9,53.34 270 top
R26  86.36,53.34 90 top
R27  82.55,59.69 270 top
R28  33.02,90.17 0 top
R29  119.38,59.69 0 top
R30  5.08,77.47 90 top
SJ1  30.48,72.39 0 top
U$1  85.09,86.36 270 top
U$2  78.74,51.44 270 top
U$5  66.04,12.7 0 top
U$9  87.63,58.42 0 top
U$10  30.48,66.04 0 top
U$11  94.56,94.61 0 top
U$12  94.56,5.79 0 top
U$13  5.61,94.61 0 top
U$14  5.61,5.79 0 top
X2  113.03,69.85 180 top

### Tracks (layer width: path | path; a pad name or v marks a point on that pad's centre or on a via)
AREF  (via drill 0.51)
  Top 0.254: R26.2 R25.1 U$9.3 90.17,59.69 90.17,60.96 84.96,66.17 C15.1 82.42,66.17 81.92,66.67 v80.01,66.67 | IC1.29 67.47,72.86 v67.94,72.39
  Bottom 0.254: v67.94,72.39 69.22,71.12 72.39,71.12 76.83,66.67 v80.01,66.67
CUR-CTRL-A  (via drill 0.51)
  Top 0.254: JP2.3 R3.1 17.65,37.97 18.41,38.73 29.84,38.73 40.64,49.53 53.34,49.53 55.88,52.07 v55.88,57.15 | IC1.40 70.65,65.88 71.12,65.41 71.75,65.41 73.03,64.14 73.03,60.33 72.39,59.69 v69.85,59.69
  Bottom 0.254: v55.88,57.15 56.52,57.78 56.52,60.96 57.78,62.23 66.04,62.23 68.58,59.69 v69.85,59.69
CUR-CTRL-B  (via drill 0.51)
  Top 0.254: JP2.1 R4.1 17.65,40.77 18.41,40.01 29.84,40.01 40.64,50.8 53.34,50.8 54.61,52.07 v54.61,54.61 | IC1.41 71.45,66.34 71.75,66.04 72.39,66.04 73.66,64.77 73.66,59.69 71.75,57.78 v69.85,57.78
  Bottom 0.254: v54.61,54.61 57.15,52.07 58.42,52.07 64.14,57.78 v69.85,57.78
DAC-CS  (via drill 0.51)
  Top 0.254: IC1.44 73.85,65.85 74.93,64.77 v76.83,64.77 | U$2.2 79.06,64.46 v79.38,64.77
  Bottom 0.254: v79.38,64.77 v76.83,64.77
EXT-CUR
  Top 0.254: C8.1 36.2,66.67 JP5.1 | U$10.5 36.75,68.66 JP5.1 | JP5.1 38.73,67.94 41.91,64.77 41.91,58.42 43.18,57.15 50.16,57.15 51.44,58.42 62.87,58.42 65.41,60.96 65.41,65.41 66.65,66.65 IC1.35
EXT-IN
  Top 0.254: PAD4.1 7.62,64.77 6.35,63.5 6.35,53.98 7.62,52.7 R7.1
  Top 1.27: PAD4.1 F3.P$1
EXT-OUT
  Top 0.254: U$10.1 27.86,63.42 24.13,59.69 R23.1
  Top 1.27: PAD3.1 R23.1
EXT-V  (via drill 0.51)
  Top 0.254: v52.07,57.15 50.8,55.88 39.37,55.88 38.1,54.61 38.1,50.8 34.29,46.99 27.94,46.99 26.92,48.01 D6.P$1 D2.P$1 24,49.65 R5.2 R7.2 | IC1.34 65.85,67.12 64.77,66.04 64.77,61.59 62.23,59.05 55.24,59.05 v54.61,59.69
  Bottom 0.254: v52.07,57.15 v54.61,59.69
GND  (via drill 0.51)
  Top 0.254: v36.2,60.33 C8.2 | v38.73,60.33 C7.2 | U$10.2 29.84,61.73 C9.2 28.45,55.12 v27.94,54.61 27.94,53.34 R5.1 | IC3.11 v66.04,53.98 | R11.1 v72.39,46.35 | U$2.7 79.06,47.3 v79.38,46.99 | U$2.5 77.77,47.28 v77.47,46.99 | U$9.2 86.86,61.09 R27.1 C15.2 | IC4.26 IC4.25 98.8,73.39 v99.06,73.66 | v100.33,68.58 100.06,68.84 IC4.18 95.52,68.84 93.85,67.18 | IC4.21 100,70.8 v100.33,71.12 | IC4.7 87.95,71.44 v87.63,71.12 | IC1.39 69.85,64.9 C1.2 71.25,61.73 v71.12,61.59 | v58.42,70.48 C3.2 58.55,72.39 60.96,72.39 62.23,73.66 IC1.28 | IC1.18 69.05,83.35 68.45,83.95 C2.2 v66.67,85.09 | IC1.6 78.11,73.66 v78.74,74.3 80.64,76.2 C13.2 | R8.2 20.32,33.02 v19.68,32.38 | C6.2 103,34.16 C5.2 | SJ1.1 29.59,74.55 v29.21,74.93 | C10.2 105.28,68.45 v105.41,68.58 | C11.2 40.51,32.89 v40.64,33.02
  pour Bottom (isolate 0.305): 1.27,99.06 121.92,99.06 121.92,1.27 1.27,1.27
LCD-BACK
  Top 0.254: R30.1 11.3,76.07 JP8.15
LCD-CONTRAST
  Top 0.254: JP8.3 12.7,92.71 26.67,92.71 29.21,90.17 R28.P2
LCD-D0
  Top 0.254: JP8.7 12.7,87.63 24.13,87.63 30.48,81.28 62.23,81.28 63.5,82.55 67.31,82.55 68.25,81.61 IC1.19
LCD-D1
  Top 0.254: JP8.8 24.13,86.36 29.84,80.64 62.87,80.64 64.14,81.92 66.67,81.92 67.45,81.14 IC1.20
LCD-D2
  Top 0.254: JP8.9 12.7,85.09 24.13,85.09 29.21,80.01 63.5,80.01 64.77,81.28 66.04,81.28 66.65,80.67 IC1.21
LCD-D3
  Top 0.254: JP8.10 24.13,83.82 28.57,79.38 64.77,79.38 64.86,79.46 IC1.22
LCD-D4
  Top 0.254: JP8.11 12.7,82.55 24.13,82.55 27.94,78.74 60.96,78.74 62.04,77.66 IC1.23
LCD-D5
  Top 0.254: JP8.12 24.13,81.28 27.3,78.11 60.33,78.11 61.57,76.86 IC1.24
LCD-D6
  Top 0.254: JP8.13 12.7,80.01 24.13,80.01 26.67,77.47 59.69,77.47 61.1,76.06 IC1.25
LCD-D7
  Top 0.254: JP8.14 24.13,78.74 26.04,76.83 59.05,76.83 60.63,75.26 IC1.26
LCD-E
  Top 0.254: JP8.6 24.13,88.9 31.11,81.92 61.59,81.92 66.67,87 71.75,87 73.03,85.72 73.03,84.45 70.65,82.08 IC1.16
LCD-RS
  Top 0.254: JP8.4 24.13,91.44 32.38,83.19 60.33,83.19 65.41,88.27 73.03,88.27 74.3,87 74.3,83.19 72.25,81.14 IC1.14
LCD-RW
  Top 0.254: JP8.5 12.7,90.17 24.13,90.17 31.75,82.55 60.96,82.55 66.04,87.63 72.39,87.63 73.66,86.36 73.66,83.82 71.45,81.61 IC1.15
LOAD-CUR
  Top 0.254: IC1.37 68.25,65.71 66.67,64.14 66.67,59.69 64.14,57.15 62.23,57.15 59.69,54.61 59.69,52.07 53.34,45.72 40.64,45.72 38.1,43.18 JP6.1 C11.1 R24.1
LOAD-IN
  Top 0.254: R6.2 19.05,29.21 17.78,30.48
  Top 1.27: PAD2.1 16.51,31.75 17.78,30.48 17.78,26.67 20.32,24.13 54.61,24.13 66.04,12.7 Q1.D
LOAD-V
  Top 0.254: IC1.36 67.45,66.18 66.04,64.77 66.04,60.33 63.5,57.78 58.42,57.78 57.15,56.52 57.15,52.07 53.34,48.26 40.64,48.26 30.48,38.1 30.48,37.08 D7.P$1 27.94,34.54 D3.P$1 26.92,33.02 R8.1 R6.1
LOADOUT
  Top 0.254: IC3.6 68.58,45.72 66.04,43.18 66.04,30.48 R18.2 | R14.2 38.1,27.94 35.56,30.48 R24.2
  Top 1.27: R18.2 Q1.S | R14.2 R13.2 R15.2 R16.2 R17.2 R18.2 | R18.2 R19.2 R20.2 R21.2 R22.2
N$1
  Top 1.016: J1.PWR 96.52,17.78 83.82,5.08 27.94,5.08 16.51,16.51 JP1.1
N$2  (via drill 0.51)
  Top 0.254: v99.06,44.45 99.06,29.21 100.33,27.94 C4.1 | R25.2 88.9,49.53 90.17,48.26 97.79,48.26 v99.06,46.99
  Top 1.016: C4.1 106.68,24.13 | 106.68,24.13 D1.C | 106.68,24.13 IC2.IN
  Bottom 0.254: v99.06,44.45 v99.06,46.99
N$3  (via drill 0.51)
  Top 0.254: v58.42,54.61 58.42,52.07 53.34,46.99 40.64,46.99 33.02,39.37 v33.02,26.67 | IC1.13 73.05,76.86 v71.12,74.93 | v63.5,67.31 63.5,61.59 62.23,60.33 v58.42,60.33 | v33.02,21.59 31.11,19.68 30.48,19.05 30.35,18.92 R2.1
  Bottom 0.254: v71.12,74.93 67.31,74.93 66.04,73.66 66.04,69.85 v63.5,67.31 | v58.42,54.61 v58.42,60.33 | v33.02,21.59 v33.02,26.67
N$4
  Top 0.254: R2.2 14.1,21.72 JP7.1
N$5
  Top 0.254: U$10.8 27.86,68.66 24.13,72.39 R23.2
  Top 1.27: F3.P$2 R23.2
N$6
  Top 0.254: R10.1 76.07,48.13 76.83,48.9 76.83,49.53 77.47,50.16 79.08,50.16 79.72,49.53 U$2.8
N$7
  Top 0.254: IC3.10 67.31,53.34 68.58,54.61 71.12,54.61 72.39,53.34 R11.2 R10.2
N$9
  Top 0.254: IC3.7 69.85,45.72 71.12,44.45 71.12,38.1 72.39,36.83 93.22,36.83 R12.1
N$10
  Top 0.254: IC3.8 IC3.9 68.58,50.8 67.31,49.53 IC3.5
N$11
  Top 0.254: Q1.G 63.5,8.26 64.77,6.99 80.64,6.99 93.34,19.68 R12.2
N$12
  Top 0.254: U$10.4 U$10.3 31.11,60.45 C9.1
N$14
  Top 0.254: IC4.16 98.83,67.55 99.69,66.67 109.12,66.67 X2.D-
N$15
  Top 0.254: IC4.15 98.2,66.89 99.06,66.04 111.76,66.04 113.03,67.31 X2.D+
N$17
  Top 0.254: IC4.23 100.03,72.09 101.6,73.66 101.6,78.74 102.87,80.01 LED1.C
N$18
  Top 0.254: LED1.A R9.1
N$19
  Top 0.254: IC4.22 96.84,71.44 92.08,66.67 92.08,62.87 92.71,62.23 107.95,62.23 110.49,59.69 LED2.C
N$20
  Top 0.254: LED2.A R29.1
N$21
  Top 1.016: D1.A 95.25,12.7 85.09,2.54 25.4,2.54
  Top 1.27: 25.4,2.54 13.97,13.97 JP1.2
N$22
  Top 0.254: IC1.30 61.9,72.06 59.05,69.22 55.24,69.22 54.61,69.85 54.61,71.12 JP3.1
N$23
  Top 0.254: IC1.31 62.37,71.26 59.69,68.58 54.61,68.58 JP4.1
N$24
  Top 0.254: IC1.32 62.84,70.46 60.33,67.94 52.7,67.94 JP9.1
N$25
  Top 0.254: IC1.33 63.31,69.66 60.96,67.31 53.34,67.31 JP10.1
N$26
  Top 0.254: SJ1.2 30.48,71.12 29.84,70.48 U$10.7
RESET  (via drill 0.51)
  Top 0.254: R1.1 95.12,87.76 92.71,90.17 83.82,90.17 82.55,88.9 U$1.5 81.28,86.36 81.28,83.82 82.55,82.55 v82.55,80.01 | IC1.4 82.22,72.06 82.55,72.39 v82.55,76.83
  Bottom 0.254: v82.55,76.83 v82.55,80.01
RX
  Top 0.254: IC4.1 89.75,75.34 87,78.11 79.38,78.11 77.33,76.06 IC1.9
SPI-MISO  (via drill 0.51)
  Top 0.254: U$1.1 86.36,86.36 v86.36,80.01 | IC1.2 83.16,70.46 v83.82,71.12
  Bottom 0.254: v86.36,80.01 86.36,73.66 v83.82,71.12
SPI-MOSI  (via drill 0.51)
  Top 0.254: U$2.4 77.77,66.38 75.65,68.5 IC1.1 83.63,69.66 85.09,71.12 v85.09,76.83 | v85.09,80.01 U$1.4
  Bottom 0.254: v85.09,76.83 v85.09,80.01
SPI-SCK  (via drill 0.51)
  Top 0.254: U$1.3 83.82,86.36 v83.82,80.01 | IC1.3 82.69,71.26 83.82,72.39 v83.82,76.83 | U$2.3 78.42,68.25 v78.74,68.58
  Bottom 0.254: v83.82,80.01 v83.82,76.83 83.82,73.66 v78.74,68.58
TX  (via drill 0.51)
  Top 0.254: IC4.5 94.33,72.75 v95.25,73.66 | IC1.10 76.86,76.86 78.74,78.74 90.17,78.74 v92.71,76.2
  Bottom 0.254: v92.71,76.2 v95.25,73.66
VCC  (via drill 0.51)
  Top 0.254: 7.62,44.45 6.35,43.18 6.35,35.56 7.62,34.29 19.05,34.29 20.45,35.69 R3.2 D7.P$2 | 7.62,44.45 19.05,44.45 20.45,43.05 R4.2 30.48,41.91 41.91,53.34 | C7.1 39.24,64.9 40.64,63.5 40.64,59.69 | 40.64,59.69 40.01,59.05 34.92,59.05 | 34.92,59.05 34.29,59.69 34.29,64.77 33.02,66.04 31.75,66.04 31.11,66.67 U$10.6 31.11,70.48 31.37,70.74 SJ1.3 | IC3.4 66.04,45.72 65.41,45.09 61.59,45.09 v58.42,48.26 60.96,50.8 60.96,53.34 63.5,55.88 69.85,55.88 | U$2.6 78.42,46.68 79.38,45.72 82.55,45.72 | 41.91,53.34 v53.34,53.34 | 41.91,53.34 v40.64,54.61 | v40.64,57.15 40.64,59.69 | 79.72,51.09 U$2.1 | 79.72,51.09 81.28,49.53 81.28,46.99 82.55,45.72 | 69.85,55.88 71.12,55.88 73.66,53.34 76.2,53.34 77.47,52.07 78.74,52.07 79.72,51.09 | 69.85,55.88 68.45,57.28 C1.1 69.05,64.1 IC1.38 69.05,73.19 | IC4.4 92.44,73.39 95.25,76.2 97.79,76.2 | 104.14,82.55 97.79,76.2 | 104.14,82.55 118.24,82.55 R9.2 R29.2 120.78,58.55 120.65,58.42 120.65,40.64 118.11,38.1 IC2.OUT | 69.05,73.19 67.78,74.46 IC1.27 57.75,74.46 C3.1 57.82,74.46 | 69.05,73.19 69.85,73.99 IC1.17 69.85,83.69 C2.1 | 69.05,73.19 69.38,72.86 IC1.5 79.21,72.86 79.88,73.53 C13.1 | 104.14,82.55 96.52,82.55 95.25,83.82 R1.2 87.76,84.96 U$1.2 | 34.92,59.05 34.92,50.42 D6.P$2 | 7.62,44.45 2.54,49.53 2.54,77.47 3.94,78.87 R30.2 5.08,87.63 8.89,91.44 8.89,95.25 10.16,96.52 12.7,96.52 13.97,95.25 JP8.2 32.82,93.98 R28.P3 | IC2.OUT 115.7,38.1 | C6.1 103,36.96 C5.1 | C6.1 108.46,42.67 105.41,45.72 82.55,45.72 | C6.1 113.16,36.96 114.3,38.1 IC2.OUT | IC4.20 101.77,70.14 C10.1 v102.87,74.93 | 97.79,76.2 99.06,76.2 v100.33,74.93
  Bottom 0.254: v53.34,53.34 v58.42,48.26 | v40.64,54.61 v40.64,57.15 | v100.33,74.93 v102.87,74.93
VREF
  Top 0.254: R26.1 85.22,51.94 83.82,53.34 83.82,55.88 U$9.1 86.23,58.29 R27.2

### Text on the board
tPlace: 1 | GND | +5V | Dummy Load V1.0 | By Joe Ferner | EXT-I Offset | PA7 | GND | VCC | PA6 | PA5 | PA4 | IN | EXT-I | EXT | OUT | EXT-V | LOAD-CTRL | LOAD | LOAD-V | GND | + | LED | PWR | SWITCH